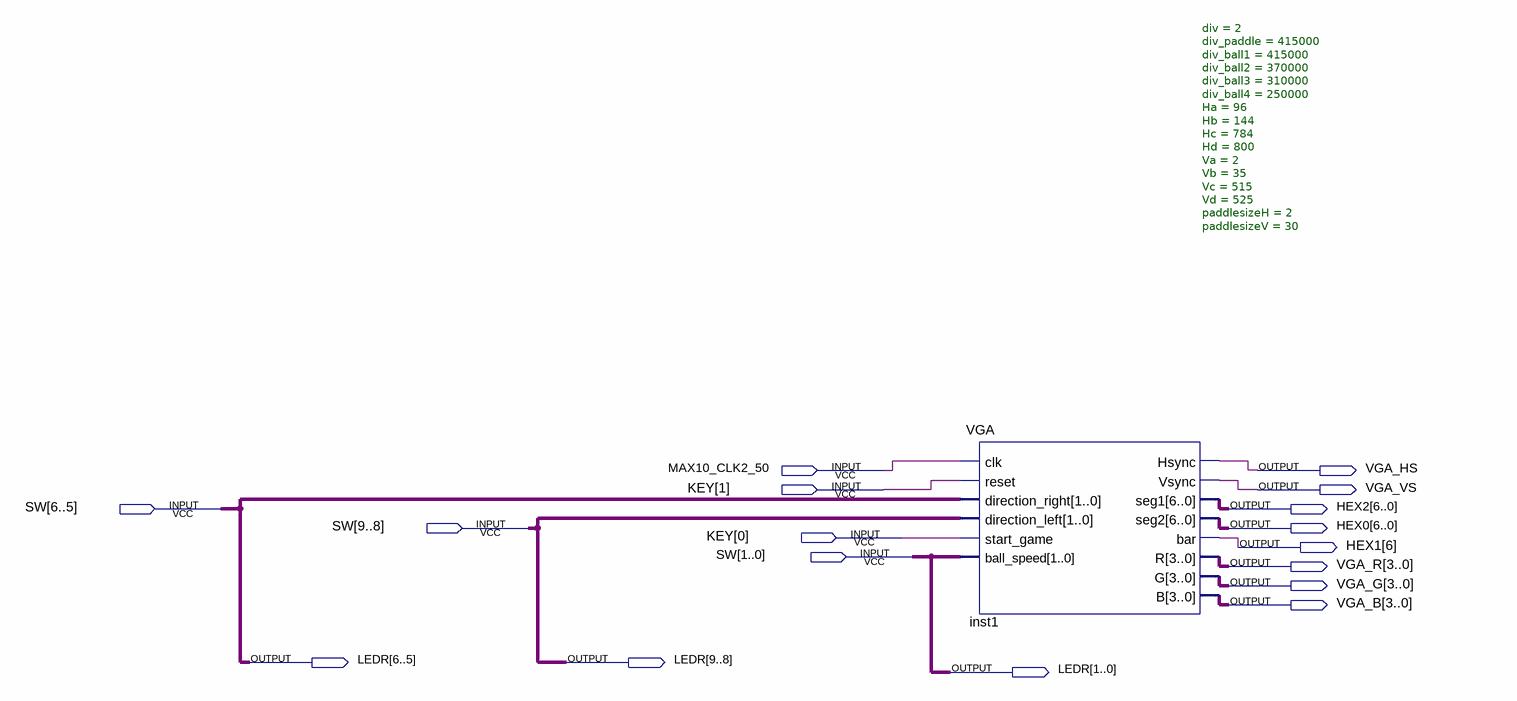
[diagram p0: schematic sheet]
// Quartus schematic vga1.bdf as structural Verilog: 1 symbols, 17 pins
module vga1 (
  input  MAX10_CLK2_50,
  input  [1:0] KEY,
  input  [9:0] SW,
  output VGA_HS,
  output VGA_VS,
  output [6:0] HEX2,
  output [6:0] HEX0,
  output [6:6] HEX1,
  output [3:0] VGA_R,
  output [3:0] VGA_G,
  output [3:0] VGA_B,
  output [9:0] LEDR
);

  VGA #(.div(2), .div_paddle(415000), .div_ball1(415000), .div_ball2(370000), .div_ball3(310000), .div_ball4(250000), .Ha(96), .Hb(144), .Hc(784), .Hd(800), .Va(2), .Vb(35), .Vc(515), .Vd(525), .paddlesizeH(2), .paddlesizeV(30)) inst1 (
    .clk(MAX10_CLK2_50), .reset(KEY[1]), .direction_right(SW[6:5]), .direction_left(SW[9:8]),
    .start_game(KEY[0]), .ball_speed(SW[1:0]), .Hsync(VGA_HS), .Vsync(VGA_VS), .seg1(HEX2), .seg2(HEX0),
    .bar(HEX1[6]), .R(VGA_R), .G(VGA_G), .B(VGA_B));

  assign {LEDR[9:8], LEDR[6:5], LEDR[1:0]} = {SW[9:8], SW[6:5], SW[1:0]};
endmodule
